# Altium schematic sheet PCB_Project_Board_4.SchDoc
size A2; SheetNumber: 1; SheetTotal: 1
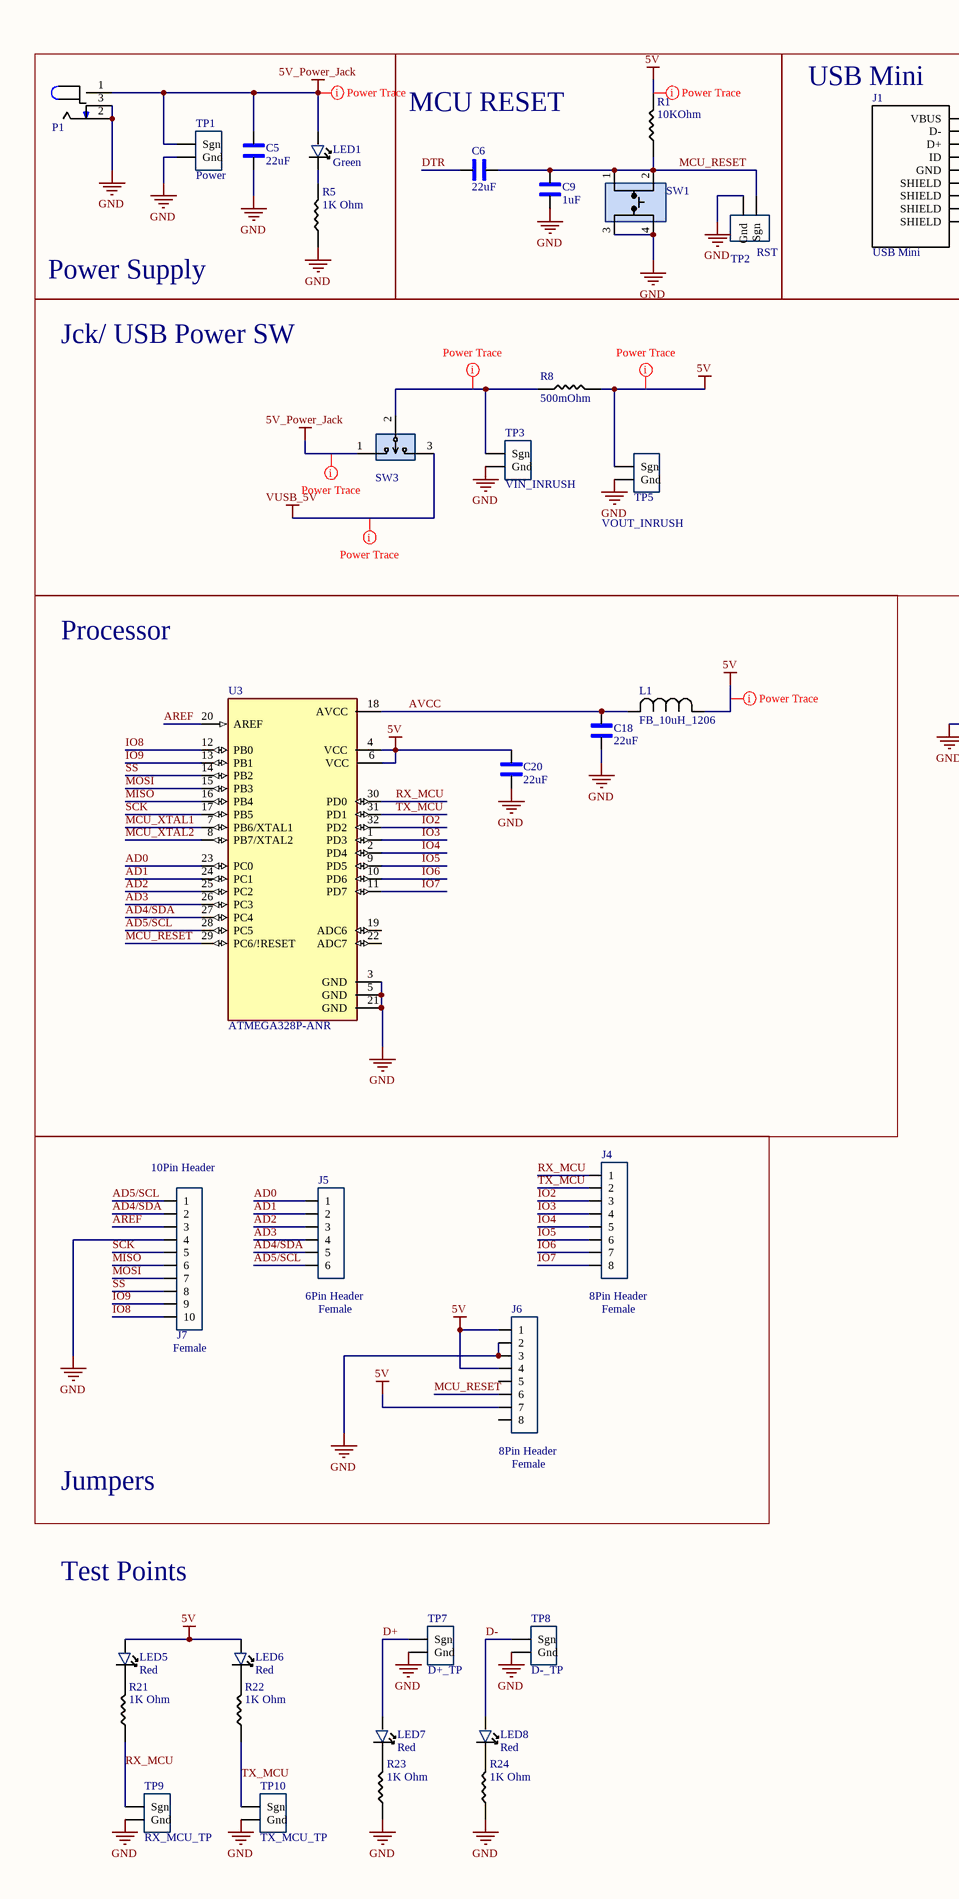
[diagram p0: PCB_Project_Board_4.SchDoc, left]
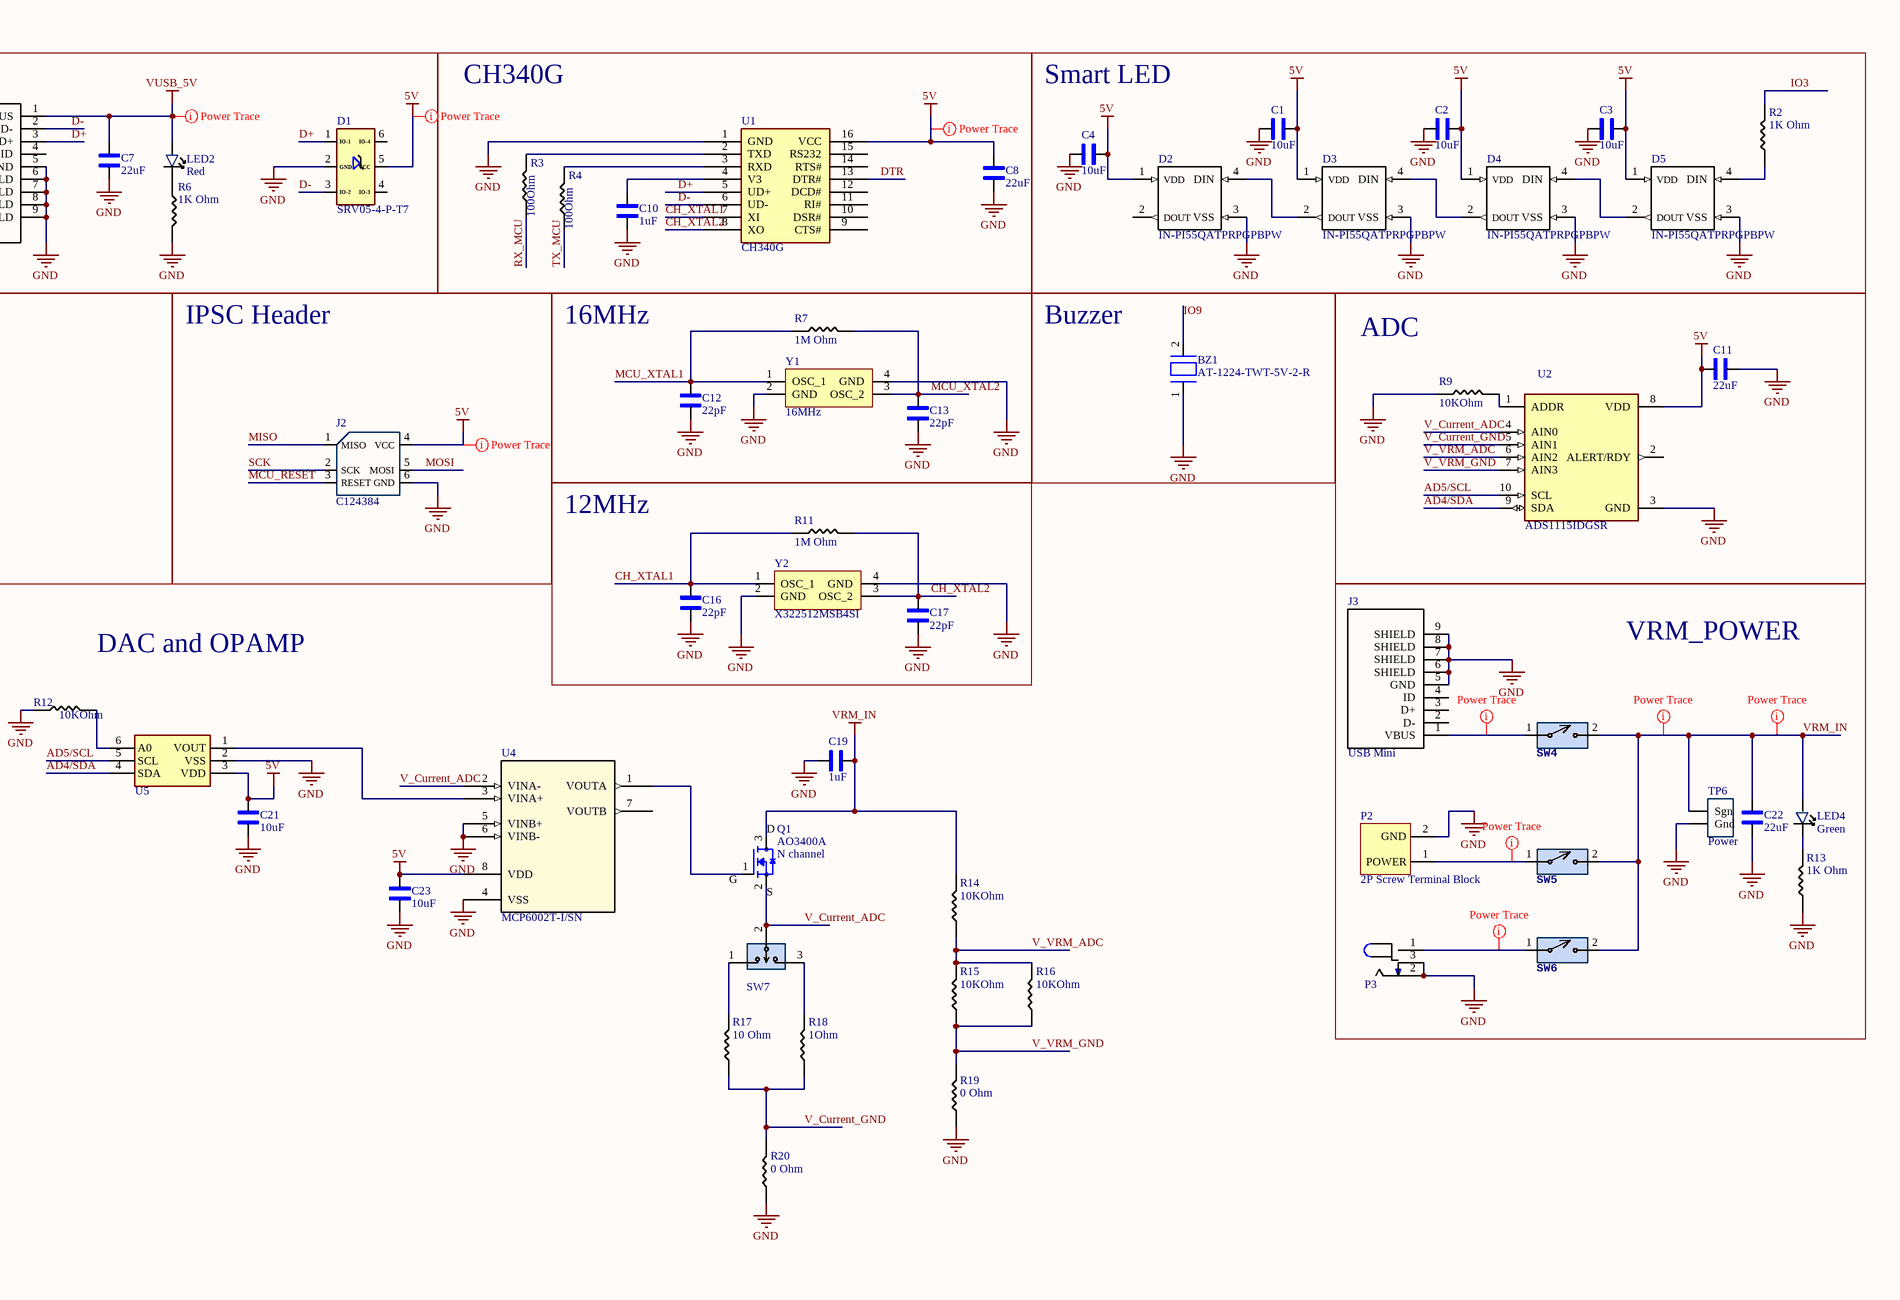
[diagram p1: PCB_Project_Board_4.SchDoc, right]

## Parts
BZ1  AT-1224-TWT-5V-2-R  [BUZZER- TH]
C1  10uF  [1206_Passive_Capacitor]
C2  10uF  [1206_Passive_Capacitor]
C3  10uF  [1206_Passive_Capacitor]
C4  10uF  [1206_Passive_Capacitor]
C5  22uF  [1206_Passive_Capacitor]
C6  22uF  [1206_Passive_Capacitor]
C7  22uF  [1206_Passive_Capacitor]
C8  22uF  [1206_Passive_Capacitor]
C9  1uF  [1206_Passive_Capacitor]
C10  1uF  [1206_Passive_Capacitor]
C11  22uF  [1206_Passive_Capacitor]
C12  22pF  [1206_Passive_Capacitor]
C13  22pF  [1206_Passive_Capacitor]
C16  22pF  [1206_Passive_Capacitor]
C17  22pF  [1206_Passive_Capacitor]
C18  22uF  [1206_Passive_Capacitor]
C19  1uF  [1206_Passive_Capacitor]
C20  22uF  [1206_Passive_Capacitor]
C21  10uF  [1206_Passive_Capacitor]
C22  22uF  [1206_Passive_Capacitor]
C23  10uF  [1206_Passive_Capacitor]
D1  SRV05-4-P-T7  [TVS]
D2  IN-PI55QATPRPGPBPW  [SERIAL_LED - duplicate]
D3  IN-PI55QATPRPGPBPW  [SERIAL_LED - duplicate]
D4  IN-PI55QATPRPGPBPW  [SERIAL_LED - duplicate]
D5  IN-PI55QATPRPGPBPW  [SERIAL_LED - duplicate]
J1  USB Mini  [USB_MINI_B]
J2  LCSC Part#: C124384  [ICSP]  (hidden comment: NRPN032PAEN-RC)
J3  USB Mini  [USB_MINI_B]
J4  8Pin Header  value Female  [8_PIN_100MIL - Female]
J5  6Pin Header  value Female  [6_PIN_100MIL -Female]
J6  8Pin Header  value Female  [8_PIN_100MIL - Female]
J7  10Pin Header  value Female  [10_PIN_100MIL - Female]
L1  FB_10uH_1206  [AIML-1206_ABR-M]
LED1  Green  [LED_1206]
LED2  Red  [LED_1206]
LED4  Green  [LED_1206]
LED5  Red  [LED_1206]
LED6  Red  [LED_1206]
LED7  Red  [LED_1206]
LED8  Red  [LED_1206]
P1  Power Jack  [Power_Jack]  (value not drawn)
P2  2P Screw Terminal Block  [P_Terminal block 3.5mm-pitch]
P3  Power Jack  [Power_Jack]  (value not drawn)
Q1  AO3400A  value N channel  [N-MOSFET]
R1  value 10KOhm  [1206_Passive_Resitor]  (hidden comment: 10k)
R2  value 1K Ohm  [1206_Passive_Resitor]  (hidden comment: 1k)
R3  100Ohm  [1206_Passive_Resitor]
R4  100Ohm  [1206_Passive_Resitor]
R5  value 1K Ohm  [1206_Passive_Resitor]  (hidden comment: 1k)
R6  value 1K Ohm  [1206_Passive_Resitor]  (hidden comment: 1k)
R7  value 1M Ohm  [1206_Passive_Resitor]  (hidden comment: 1M)
R8  value 500mOhm  [1206_Passive_Resitor]  (hidden comment: 500m)
R9  value 10KOhm  [1206_Passive_Resitor]  (hidden comment: 10k)
R11  value 1M Ohm  [1206_Passive_Resitor]  (hidden comment: 1M)
R12  value 10KOhm  [1206_Passive_Resitor]  (hidden comment: 10k)
R13  value 1K Ohm  [1206_Passive_Resitor]  (hidden comment: 1k)
R14  value 10KOhm  [1206_Passive_Resitor]  (hidden comment: 10k)
R15  value 10KOhm  [1206_Passive_Resitor]  (hidden comment: 10k)
R16  value 10KOhm  [1206_Passive_Resitor]  (hidden comment: 10k)
R17  10 Ohm  [1206_Passive_Resitor]
R18  value 1Ohm  [1206_Passive_Resitor]  (hidden comment: 1 Ohm)
R19  0 Ohm  [1206_Passive_Resitor]
R20  0 Ohm  [1206_Passive_Resitor]
R21  value 1K Ohm  [1206_Passive_Resitor]  (hidden comment: 1k)
R22  value 1K Ohm  [1206_Passive_Resitor]  (hidden comment: 1k)
R23  value 1K Ohm  [1206_Passive_Resitor]  (hidden comment: 1k)
R24  value 1K Ohm  [1206_Passive_Resitor]  (hidden comment: 1k)
SW1  TL3305AF160QG  [Switch_JLC]  (value not drawn)
SW3  PREC003SAAN-RC  [3_PIN_100mil]  (value not drawn)
SW4  SW_2Pin_100mil_Switch  [2Pin-Header-Conn]  (value not drawn)
SW5  SW_2Pin_100mil_Switch  [2Pin-Header-Conn]  (value not drawn)
SW6  SW_2Pin_100mil_Switch  [2Pin-Header-Conn]  (value not drawn)
SW7  PREC003SAAN-RC  [3_PIN_100mil]  (value not drawn)
TP1  Power  [TP10x_Probe]
TP2  RST  [TP10x_Probe]
TP3  VIN_INRUSH  [TP10x_Probe]
TP5  VOUT_INRUSH  [TP10x_Probe]
TP6  Power  [TP10x_Probe]
TP7  D+_TP  [TP10x_Probe]
TP8  D-_TP  [TP10x_Probe]
TP9  RX_MCU_TP  [TP10x_Probe]
TP10  TX_MCU_TP  [TP10x_Probe]
U1  CH340G  [USB to serial]
U2  ADS1115IDGSR  [ADC_ADS1115IDGSR]
U3  ATMEGA328P-ANR  [ATMega328P]
U4  MCP6002T-I/SN  [SOIC127P600X175-8N]
U5  DAC IC  [MCP4725]  (value not drawn)
Y1  value 16MHz  [Crystal resonator]  (hidden comment: X322516MLB4SI)
Y2  X322512MSB4SI  [Crystal resonator]

## Blocks framed on the sheet
Power Supply: C5 LED1 P1 R5 TP1
MCU RESET: C6 C9 R1 SW1 TP2
USB Mini: C7 D1 J1 LED2 R6
CH340G: C8 C10 R3 R4 U1
Smart LED: C1-C4 D2-D5 R2
Jck/ USB Power SW: R8 SW3 TP3 TP5
IPSC Header: J2
16MHz: C12 C13 R7 Y1
Buzzer: BZ1
ADC: C11 R9 U2
12MHz: C16 C17 R11 Y2
Processor: C18 C20 L1 U3
VRM_POWER: C22 J3 LED4 P2 P3 R13 SW4-SW6 TP6
Jumpers: J4-J7

## Nets
5V: C1.2 C2.2 C3.2 C4.2 C8.2 C11.1 C20.2 C21.2 C23.2 D1.5(VCC) D2.1(VDD) D3.1(VDD) D4.1(VDD) D5.1(VDD) J2.4(VCC) J6.1 J6.4 J6.7 L1.1 LED5.1 LED6.1 R1.2 R8.2 TP5.1(Sgn) U1.16(VCC) U2.8(VDD) U3.4(VCC) U3.6(VCC) U4.8(VDD) U5.3(VDD)
5V_Power_Jack: C5.2 LED1.1 P1.1 SW3.1 TP1.1(Sgn)
GND: BZ1.1(BZ1) C1.1 C2.1 C3.1 C4.1 C5.1 C7.1 C8.1 C9.1 C10.1 C11.2 C12.1 C13.1 C16.1 C17.1 C18.1 C19.1 C20.1 C21.1 C22.1 C23.1 D1.2(GND) D2.3(VSS) D3.3(VSS) D4.3(VSS) D5.3(VSS) J1.5(GND) J1.6(SHIELD) J1.7(SHIELD) J1.8(SHIELD) J1.9(SHIELD) J2.6(GND) J3.5(GND) J3.6(SHIELD) J3.7(SHIELD) J3.8(SHIELD) J3.9(SHIELD) J6.2 J6.3 J7.4 P1.2 P1.3 P2.2(GND) P3.2 P3.3 R5.1 R6.2 R9.1 R12.1 R13.1 R19.1 R20.1 R23.1 R24.1 SW1.3 SW1.4 TP1.2(Gnd) TP2.2(Gnd) TP3.2(Gnd) TP5.2(Gnd) TP6.2(Gnd) TP7.2(Gnd) TP8.2(Gnd) TP9.2(Gnd) TP10.2(Gnd) U1.1(GND) U2.3(GND) U3.3(GND) U3.5(GND) U3.21(GND) U4.4(VSS) U4.5(VINB+) U4.6(VINB-) U5.2(VSS) Y1.2(GND) Y1.4(GND) Y2.2(GND) Y2.4(GND)
VRM_IN: C19.2 C22.2 LED4.1 Q1.3(D) R14.2 SW4.2 SW5.2 SW6.2 TP6.1(Sgn)
VUSB_5V: C7.2 J1.1(VBUS) LED2.1 SW3.3
AD0: J5.1 U3.23(PC0)
AD1: J5.2 U3.24(PC1)
AD2: J5.3 U3.25(PC2)
AD3: J5.4 U3.26(PC3)
AD4/SDA: J5.5 J7.2 U2.9(SDA) U3.27(PC4) U5.4(SDA)
AD5/SCL: J5.6 J7.1 U2.10(SCL) U3.28(PC5) U5.5(SCL)
AREF: J7.3 U3.20(AREF)
AVCC: C18.2 L1.2 U3.18(AVCC)
CH_XTAL1: C16.2 R11.1 U1.7(XI) Y2.1(OSC_1)
CH_XTAL2: C17.2 R11.2 U1.8(XO) Y2.3(OSC_2)
D+: D1.1(IO-1) J1.3(D+) LED7.1 TP7.1(Sgn) U1.5(UD+)
D-: D1.3(IO-2) J1.2(D-) LED8.1 TP8.1(Sgn) U1.6(UD-)
DTR: C6.1 U1.13(DTR#)
IO2: J4.3 U3.32(PD2)
IO3: J4.4 R2.2 U3.1(PD3)
IO4: J4.5 U3.2(PD4)
IO5: J4.6 U3.9(PD5)
IO6: J4.7 U3.10(PD6)
IO7: J4.8 U3.11(PD7)
IO8: J7.10 U3.12(PB0)
IO9: BZ1.2(BZ2) J7.9 U3.13(PB1)
MCU_RESET: C6.2 C9.2 J2.3(RESET) J6.6 R1.1 SW1.1 SW1.2 TP2.1(Sgn) U3.29(PC6/!RESET)
MCU_XTAL1: C12.2 R7.1 U3.7(PB6/XTAL1) Y1.1(OSC_1)
MCU_XTAL2: C13.2 R7.2 U3.8(PB7/XTAL2) Y1.3(OSC_2)
MISO: J2.1(MISO) J7.6 U3.16(PB4)
MOSI: J2.5(MOSI) J7.7 U3.15(PB3)
RX_MCU: J4.1 R3.1 R21.1 TP9.1(Sgn) U3.30(PD0)
SCK: J2.2(SCK) J7.5 U3.17(PB5)
SS: J7.8 U3.14(PB2)
TX_MCU: J4.2 R4.1 R22.1 TP10.1(Sgn) U3.31(PD1)
V_Current_ADC: Q1.2(S) SW7.2 U2.4(AIN0) U4.2(VINA-)
V_Current_GND: R17.1 R18.1 R20.2 U2.5(AIN1)
V_VRM_ADC: R14.1 R15.2 R16.2 U2.6(AIN2)
V_VRM_GND: R15.1 R16.1 R19.2 U2.7(AIN3)
NetC10_2: C10.2 U1.4(V3)
NetD2_4: D2.4(DIN) D3.2(DOUT)
NetD3_4: D3.4(DIN) D4.2(DOUT)
NetD4_4: D4.4(DIN) D5.2(DOUT)
NetD5_4: D5.4(DIN) R2.1
NetJ3_1: J3.1(VBUS) SW4.1
NetLED1_2: LED1.2 R5.2
NetLED2_2: LED2.2 R6.1
NetLED4_2: LED4.2 R13.2
NetLED5_2: LED5.2 R21.2
NetLED6_2: LED6.2 R22.2
NetLED7_2: LED7.2 R23.2
NetLED8_2: LED8.2 R24.2
NetP2_1: P2.1(POWER) SW5.1
NetP3_1: P3.1 SW6.1
NetQ1_1: Q1.1(G) U4.1(VOUTA)
NetR3_2: R3.2 U1.2(TXD)
NetR4_2: R4.2 U1.3(RXD)
NetR8_1: R8.1 SW3.2 TP3.1(Sgn)
NetR9_2: R9.2 U2.1(ADDR)
NetR12_2: R12.2 U5.6(A0)
NetR17_2: R17.2 SW7.1
NetR18_2: R18.2 SW7.3
NetU4_3: U4.3(VINA+) U5.1(VOUT)

Not connected (* = marked no-connect by the designer): D1 4(IO-3) 6(IO-4); D2 2(DOUT); J1 4(ID); J3 2(D-) 3(D+) 4(ID); J6 5 8; U1 9(CTS#) 10(DSR#) 11(RI#) 12(DCD#) 14(RTS#) 15(RS232); U2 2(ALERT/RDY); U3 19(ADC6) 22(ADC7); U4 7(VOUTB)

## Layout directives
rule Width Constraint [Pref Width = 20mil    Min Width = 10mil    Max Width = 100mil]: 5V, 5V_Power_Jack, NetJ3_1, NetP2_1, NetP3_1, NetR8_1, VRM_IN, VUSB_5V

## Notes on the sheet
- DAC and OPAMP
- Test Points

## Library data of the parts
BZ1 = BUZZER_1: Buzzers Transducer, Externally Driven Electromechanical/Magnetic 5 V 40mA 2.4kHz 87dB @ 5V, 10cm Through Hole PC Pins; Datasheet: https://www.puiaudio.com/media/SpecSheet/AT-1224-TWT-5V-2-R.pdf; MFR Part #: AT-1224-TWT-5V-2-R
C1-C4 C21 C23 = C_10uF_1206: 10uF ±10% 50V X5R 1206 Multilayer Ceramic Capacitors MLCC - SMD/SMT RoHS; MFR Part #: CL31A106KBHNNNE; Type: Basic; LCSC Part#: C13585; Datasheet: https://datasheet.lcsc.com/lcsc/1810221112_Samsung-Electro-Mechanics-CL31A106KBHNNNE_C13585.pdf; Value: 10uF
C5-C8 C11 C18 C20 C22 = C_22uF_1206: 22uF ±10% 25V X5R 1206 Multilayer Ceramic Capacitors MLCC - SMD/SMT RoHS; MFR Part #: CL31A226KAHNNNE; Type: basic; LCSC Part#: C12891; Datasheet: https://datasheet.lcsc.com/lcsc/1811031514_Samsung-Electro-Mechanics-CL31A226KAHNNNE_C12891.pdf; Value: 22uF
C9 C10 C19 = C_1uF_1206: MULTILAYER CERAMIC CAPACITORS MLCC - SMD/SMT 1UF 50V 1206 ROHS; MFR Part #: CL31B105KBHNNNE; Type: Basic; Digikey Link: https://www.digikey.com/product-detail/en/C1206C105M4RACTU/399-8150-1-ND/3471873/?itemSeq=304982366; LCSC Part#: C1848; Value: 1uF
C12 C13 C16 C17 = C_22pF_1206: 22pF ±5% 1kV C0G 1206 Multilayer Ceramic Capacitors MLCC - SMD/SMT RoHS; MFR Part #: 1206CG220J102NT; Type: Extended; LCSC Part#: C313096; Datasheet: https://datasheet.lcsc.com/lcsc/1810311150_FH-Guangdong-Fenghua-Advanced-Tech-1206CG220J102NT_C313096.pdf; Value: 22pF
D1 = D_TVS_Diode: TVS SOT-23-6 ROHS; Value: TVS DIODE 5.5V 6TSOP; Type: Basic; MFR Part #: SRV05-4-P-T7; LCSC Part#: C85364; Datasheet: https://datasheet.lcsc.com/szlcsc/ProTek-Devices-SRV05-4-P-T7_C85364.pdf
D2-D5 = LED_Smart: LIGHT EMITTING DIODES (LED) RGB 620~630NM RED, 520~530NM GREEN, 465~475NM BLUE 600MCD@16MARED,1200MCD@16MAGREEN,300MCD@16MABLUE TOP VIEW SMD-4 ROHS; MFR Part #: IN-PI55QATPRPGPBPW-60; Manufacturer: Inolux; LCSC Part#: C2761795; DataSheet: https://datasheet.lcsc.com/lcsc/2106062036_Worldsemi-WS2812B-B-W_C2761795.pdf
J1 J3 = J_USB_B_Mini: Through Hole USB Connectors RoHS; MFR Part #: 920-462A2021D10102; Value: USB mini B; LCSC Part#: C46398; Datasheet: https://datasheet.lcsc.com/szlcsc/2103081233_Jing-Extension-of-the-Electronic-Co-920-462A2021D10102_C46398.pdf; Type: Extended
J2 = J_ICSP: Connector Header Through Hole 6 position 0.079" (2.00mm); Digikey Link: https://www.digikey.com/product-detail/en/NRPN032PAEN-RC/S5801-03-ND/804955/?itemSeq=304982355; MFR Part #: NRPN032PAEN-RC; Type: Extended
J4 J6 = JF_8_PIN_FEMALE: 8 Position Header Connector 0.100" (2.54mm) Through Hole Tin; MFR Part #: PPTC081LFBN-RC; Digikey Link: https://www.digikey.com/product-detail/en/PPTC081LFBN-RC/S7006-ND/810147/?itemSeq=304982354; Type: Extended; LCSC Part#: C27438
J5 = JF_6_PIN_FEMALE: 6 Position Header Connector 0.100" (2.54mm) Through Hole Tin; MFR Part #: PPTC061LFBN-RC; Digikey Link: https://www.digikey.com/product-detail/en/PPTC061LFBN-RC/S7004-ND/810145/?itemSeq=304982353; LCSC Part#: C40877; Type: Extended
J7 = JF_10_PIN_FEMALE_: 10 Position Header Connector 0.100" (2.54mm) Through Hole Tin; MFR Part #: PPTC101LFBN-RC; Digikey Link: https://www.digikey.com/product-detail/en/PPTC101LFBN-RC/S7008-ND/810149/?itemSeq=304982352; LCSC Part#: C225507; Type: Extended
L1 = FB_10uH_1206: 25mA 10uH ±10% 800mΩ 1206  Inductors (SMD) ROHS; Mfr_Name: FH (Guangdong Fenghua Advanced Tech); MFR PART #: CMI321609X100KT; Type: Basic; LCSC PART#: C1051; DataSheet: https://datasheet.lcsc.com/lcsc/1810311314_FH--Guangdong-Fenghua-Advanced-Tech-CMI321609X100KT_C1051.pdf
LED1 LED4 = LED_GREEN_1206: Green 513~528nm 1206 Light Emitting Diodes (LED) RoHS; MFR Part #: SZYY1206G; Type: Extended; LCSC Part#: C434439; Datasheet: https://datasheet.lcsc.com/lcsc/2006301532_Yongyu-Photoelectric-SZYY1206G_C434439.pdf; Value: Green
LED2 LED5-LED8 = LED_RED_1206: Red 621~631nm 1206 Light Emitting Diodes (LED) RoHS; MFR Part #: 15-21/R6C-FQ1R1B/2T; Type: Extended; LCSC Part#: C93133; Datasheet: https://datasheet.lcsc.com/szlcsc/1811151241_Everlight-Elec-15-21-R6C-FQ1R1B-2T_C93133.pdf; Value: Red
P1 P3 = P_Power Jack: Power Barrel Connector Jack 2.10mm ID (0.083"), 5.50mm OD (0.217") Through Hole, Right Angle; MFR Part #: PJ-102A; Value: CONN PWR JACK 2X5.5MM SOLDER; Digikey Link: https://www.digikey.com/product-detail/en/PJ-102A/CP-102A-ND/275425/?itemSeq=304982367; LCSC Part#: C136744; Type: Extended
P2 = P_Terminal block: Green Straight pin 3.5mm  pitch; P=3.5mm  Screw terminal ROHS; MFR Part #: KF350-3.5-2P; Manufacturer: Cixi Kefa Elec; LCSC Part#: C474892; DataSheet: https://datasheet.lcsc.com/lcsc/2001160007_Cixi-Kefa-Elec-KF350-3-5-2P_C474892.pdf
Q1 = Q_Nch_MOSFET: MOSFET N Trench 30V 5.7A 1.5V @ 250uA 26.5 m? @ 5.7A,10V SOT-23-3L RoHS; Type: Basic; LCSC Part#: C20917; Datasheet: https://datasheet.lcsc.com/szlcsc/Alpha-Omega-Semicon-AOS-AO3400A_C20917.pdf; MFR Part #: AO3400A
R1 R9 R12 R14-R16 = R_10KOhm_1206: 10 kOhms ±5% 0.25W, 1/4W Chip Resistor 1206 (3216 Metric) Automotive AEC-Q200 Thick Film; MFR Part #: RMCF1206FT10K0; Digikey Link: https://www.digikey.com/en/products/detail/stackpole-electronics-inc/RMCF1206FT10K0/1759669; LCSC Part#: C17902; Type: Basic
R2 R5 R6 R13 R21-R24 = R_1K_1206: CHIP RESISTOR - SURFACE MOUNT 1KOHMS ±1% 1/4W 1206 ROHS; MFR Part #: RNCP1206FTD1K00CT; Digikey Link: https://www.digikey.com/product-detail/en/RNCP1206FTD1K00/RNCP1206FTD1K00CT-ND/2240675/?itemSeq=304982373; LCSC Part#: C4410; Type: Basic
R3 R4 = R_100Ohm_1206: 100Ω ±1% 0.25W ±100ppm/℃ 1206 Chip Resistor - Surface Mount RoHS; MFR Part #: 1206W4F1000T5E; LCSC Part#: C17901; Datasheet: https://datasheet.lcsc.com/lcsc/2206010145_UNI-ROYAL-Uniroyal-Elec-1206W4F1000T5E_C17901.pdf; Type: Basic; Value: 100Ohm
R7 R11 = R_1M_1206: CHIP RESISTOR - SURFACE MOUNT 1MOHMS ±1% 1/4W 1206 ROHS; MFR Part #: RMCF1206JT1M00; Digikey Link: https://www.digikey.com/product-detail/en/RMCF1206JT1M00/RMCF1206JT1M00CT-ND/1942830/?itemSeq=304982358; LCSC Part#: C17927; Type: Basic
R8 = R_500mOhm_1206: Resistors/Shunt 250mW 500mΩ ±800ppm/℃ ±5% 1206  Current Sense  Resistors ROHS; MFR Part #: 1206W4J050KT5E; Datasheet: https://datasheet.lcsc.com/lcsc/1810301438_UNI-ROYAL-Uniroyal-Elec-1206W4J050KT5E_C247433.pdf; LCSC Part#: C247433; Type: Extended
R17 = R_10Ohm_1206: CHIP RESISTOR - SURFACE MOUNT 0.1OHMS ±1% 1/4W 1206 ROHS; MFR Part #: 1206W4F100JT5E; Datasheet: https://datasheet.lcsc.com/szlcsc/Uniroyal-Elec-1206W4F100JT5E_C17903.pdf; LCSC Part#: C17903; Type: Basic; Value: 10 Ohm
R18 = R_1Ohm_1206: 1Ω ±5% 0.25W ±400ppm/℃ 1206 Chip Resistor - Surface Mount RoHS; MFR Part #: 1206W4J010JT5E; LCSC Part#: C1409; Datasheet: https://datasheet.lcsc.com/lcsc/1810301410_UNI-ROYAL-Uniroyal-Elec-1206W4J010JT5E_C1409.pdf; Type: Extended
R19 R20 = R_0Ohm_1206: CHIP RESISTOR - SURFACE MOUNT 0OHMS ±1% 1/4W 1206 ROHS; MFR Part #: 1206W4F0000T5E; Datasheet: https://datasheet.lcsc.com/szlcsc/Uniroyal-Elec-1206W4F0000T5E_C17888.pdf; LCSC Part#: C17888; Type: Basic; Mouser link: https://www.mouser.com/ProductDetail/Royalohm/1206W4F0000T5E?qs=e8oIoAS2J1Thbopin%252BsagQ%3D%3D; Value: 0 Ohm
SW1 = SW_Push_Button_JLC: Tactile Switch SPST-NO Top Actuated Surface Mount; MFR Part #: KH-4.5X4.5X4.3H-STM; LCSC Part#: C2837550; Type: Extended; DataSheet: https://datasheet.lcsc.com/lcsc/2106081532_Shenzhen-Kinghelm-Elec-KH-4.5X4.5X4.3H-STM_C2837550.pdf
SW3 SW7 = SW_3Pin_100mil_Switch: Connector Header Through Hole 3 position 0.100" (2.54mm); Value: CONN HEADER VERT 3POS 2.54MM; Digikey Link: https://www.digikey.com/product-detail/en/PREC003SAAN-RC/S1012EC-03-ND/2774851/?itemSeq=304982371; MFR Part #: PREC003SAAN-RC; Type: Extended; LCSC Part#: C49257
SW4-SW6 = SW_2Pin_100mil_Switch: 2Pin Header; LCSC Part#: C124375; Type: Extended
TP1-TP3 TP5-TP10 = TP_10x_Probe: Test Point 300 mil centers
U1 = U_USBtoSerial: Transceiver USB 2.0 2Mbps SOP-16_150mil USB ICs RoHS; Datasheet: https://datasheet.lcsc.com/lcsc/2008191806_WCH-Jiangsu-Qin-Heng-CH340G_C14267.pdf; LCSC Part#: C14267; MFR Part #: CH340G; Type: Basic; Value: USB to Serial
U2 = U_ADC_ADS1115IDGSR: 16-Bit ADC with Integrated MUX, PGA, Comparator, Oscillator, and Reference 10-VSSOP -40 to 125; MFR Part #: ADS1115IDGSR; Package: MSOP-10 Texas Instruments; LCSC Part#: C37593; SnapEDA_Link: https://www.snapeda.com/parts/ADS1115IDGSR/Texas%20Instruments/view-part/?ref=snap; Type: Extended; DigiKey link: https://www.digikey.com/product-detail/en/texas-instruments/ADS1115IDGSR/296-38849-1-ND/5142969?utm_source=snapeda&utm_medium=aggregator&utm_campaign=symbol; Value: *
U3 = U_ATMega328P: AVR AVR® ATmega Microcontroller IC 8-Bit 20MHz 32KB (16K x 16) FLASH 32-TQFP (7x7); MFR Part #: ATMEGA328P-AU; Value: IC MCU 8BIT 32KB FLASH 32TQFP; Digikey Link: https://www.digikey.com/product-detail/en/ATMEGA328P-ANR/ATMEGA328P-ANRCT-ND/2774230/?itemSeq=304982365; LCSC Part#: C14877; Type: Basic
U4 = U_MCP6002T-I/SN: 0.6 V/us 2 1MHz 1.8V ~ 6V 100μA General Purpose SOIC-8_150mil  Operational Amplifier ROHS; Mfr: Microchip; MFR Part #: MCP6002T-I/SN; DataSheet: https://ww1.microchip.com/downloads/en/DeviceDoc/MCP6001-1R-1U-2-4-1-MHz-Low-Power-Op-Amp-DS20001733L.pdf; LCSC Part#: C7377; Type: Basic
U5 = U_MCP4725A0T-E/CH: IC DAC 12BIT V-OUT SOT23-6; Datasheet: https://ww1.microchip.com/downloads/en/DeviceDoc/22039d.pdf; LCSC Part#: C144198; type: Extended; MFR Part #: MCP4725A0T-E/CH
Y1 = X_16Mhz_Res: ±10ppm 16000000Hz -40℃~85℃ 贴片无源晶振 60Ω 9pF SMD3225-4P Crystals ROHS; LCSC Part#: C13738; MFR Part #: X322516MLB4SI; Type: Basic
Y2 = X_12MHz_Res: SMD Crystal Resonators 12MHz ±10ppm SMD-3225_4P RoHS; LCSC Part#: C9002; MFR Part #: X322512MSB4SI; Value: 12MHz; Type: Basic; Datasheet: https://datasheet.lcsc.com/szlcsc/Yangxing-Tech-X322512MSB4SI_C9002.pdf